# Altium schematic sheet Sheet1.SchDoc
size A4
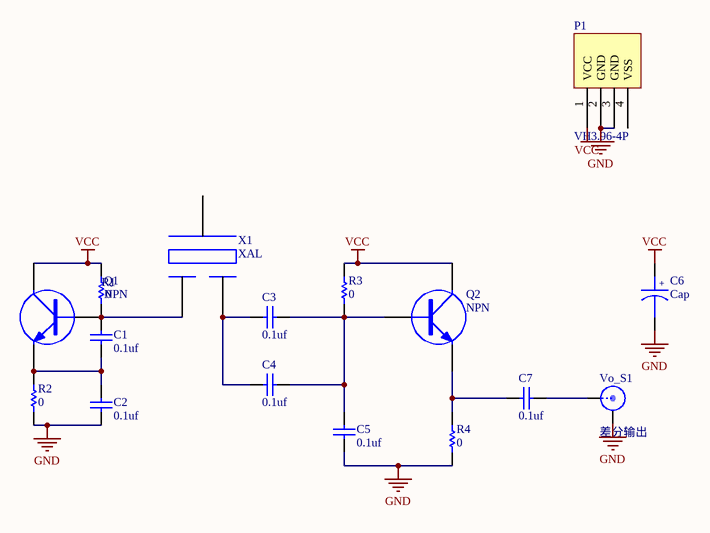
[diagram p0: Sheet1.SchDoc]

## Parts
C1  0.1uf  [0805]
C2  0.1uf  [0805]
C3  0.1uf  [0805]
C4  0.1uf  [0805]
C5  0.1uf  [0805]
C6  Cap  [7343C-TYPE_D]
C7  0.1uf  [0805]
P1  VH3.96-4P  [VH3.96-4P]
Q1  NPN  [TO-92]
Q2  NPN  [TO-92]
R1  0  [0805]
R2  0  [0805]
R3  0  [0805]
R4  0  [0805]
Vo_S1  差分输出  [SMA-LYING]
X1  XAL  [DIP-3P]

## Nets
GND: C2.1 C5.2 C6.2 P1.2(GND) P1.3(GND) R2.1 R4.1 Vo_S1.1
VCC: C6.1 P1.1(VCC) Q1.1(C) Q2.1(C) R1.2 R3.2
NetC1_1: C1.1 C2.2 Q1.3(E) R2.2
NetC1_2: C1.2 Q1.2(B) R1.1 X1.1
NetC3_1: C3.1 C4.1 C5.1 Q2.2(B) R3.1
NetC3_2: C3.2 C4.2 X1.3
NetC7_1: C7.1 Q2.3(E) R4.2
NetC7_2: C7.2 Vo_S1.0

Not connected (* = marked no-connect by the designer): P1 4(VSS); X1 2

## Notes on the sheet
- (in symbol Tantalium Cap) +

## Library data of the parts
C1-C5 C7 = Cap
C6 = Tantalium Cap
Q1 Q2 = NPN: NPN Transistor
R1-R4 = Res
Vo_S1 = SMA